# Altium project TASBot64.PrjPCB
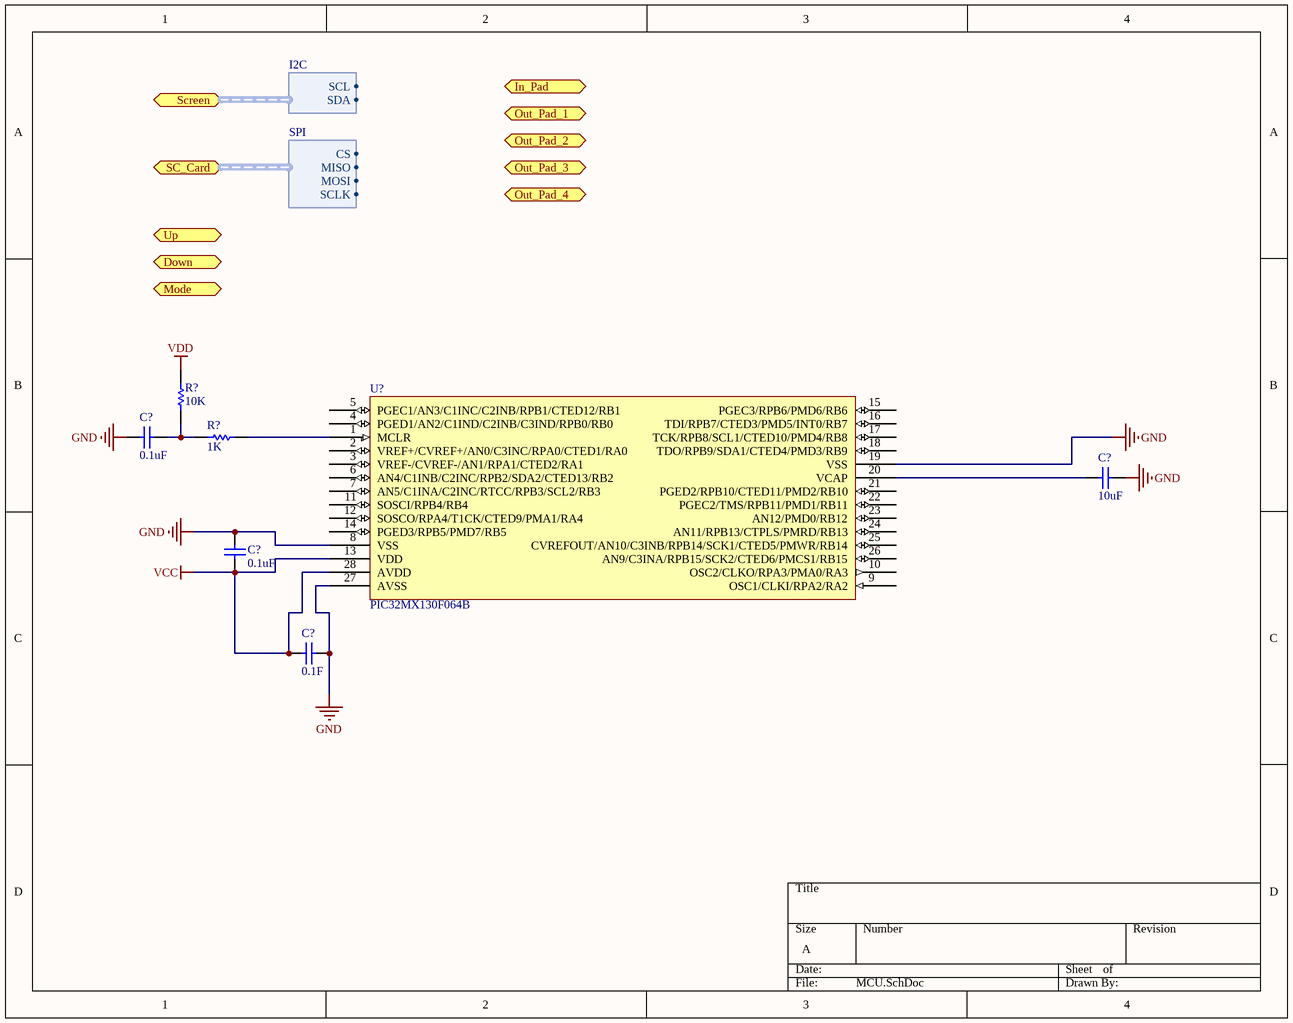
[diagram p0: MCU.SchDoc]
5 sheets, 23 parts. Net scope: hierarchical (ports join the sheet entries above them; power ports are global).
Sheets:
  MCU.SchDoc
  TASBot64.SchDoc
    U_SD = SD.SchDoc
    U_Screen = Screen.SchDoc
    U_Protoboard = Protoboard.SchDoc

## Sheet MCU.SchDoc
size A

### Parts
(Parts that share a designator on the sheet are numbered #1, #2 ... from top to bottom, then left to right.)
C?#1  0.1uF  [RAD-0.3]
C?#2  10uF  [RAD-0.3]
C?#3  0.1uF  [RAD-0.3]
C?#4  0.1F  [RAD-0.3]
R?#1  10K  [AXIAL-0.3]
R?#2  1K  [AXIAL-0.3]
U?#1  PIC32MX130F064B

### Ports
Down (in), In_Pad (bidir), Mode (in), Out_Pad_1 (bidir), Out_Pad_2 (bidir), Out_Pad_3 (bidir), Out_Pad_4 (bidir), SC_Card (harness SPI), Screen (harness I2C), Up (in)

### Harnesses
I2C: SCL, SDA
SPI: CS, MISO, MOSI, SCLK

### Nets
GND: C?#1.1 C?#2.2 C?#3.2 C?#4.2 U?#1.8(VSS) U?#1.19(VSS) U?#1.27(AVSS)
VCC: C?#3.1 C?#4.1 U?#1.13(VDD) U?#1.28(AVDD)
VDD: R?#1.2
NetC?#1_2: C?#1.2 R?#1.1 R?#2.1
NetC?#2_1: C?#2.1 U?#1.20(VCAP)
NetR?#2_2: R?#2.2 U?#1.1(MCLR)

Not connected (* = marked no-connect by the designer): U?#1 2(VREF+/CVREF+/AN0/C3INC/RPA0/CTED1/RA0) 3(VREF-/CVREF-/AN1/RPA1/CTED2/RA1) 4(PGED1/AN2/C1IND/C2INB/C3IND/RPB0/RB0) 5(PGEC1/AN3/C1INC/C2INB/RPB1/CTED12/RB1) 6(AN4/C1INB/C2INC/RPB2/SDA2/CTED13/RB2) 7(AN5/C1INA/C2INC/RTCC/RPB3/SCL2/RB3) 9(OSC1/CLKI/RPA2/RA2) 10(OSC2/CLKO/RPA3/PMA0/RA3) 11(SOSCI/RPB4/RB4) 12(SOSCO/RPA4/T1CK/CTED9/PMA1/RA4) 14(PGED3/RPB5/PMD7/RB5) 15(PGEC3/RPB6/PMD6/RB6) 16(TDI/RPB7/CTED3/PMD5/INT0/RB7) 17(TCK/RPB8/SCL1/CTED10/PMD4/RB8) 18(TDO/RPB9/SDA1/CTED4/PMD3/RB9) 21(PGED2/RPB10/CTED11/PMD2/RB10) 22(PGEC2/TMS/RPB11/PMD1/RB11) 23(AN12/PMD0/RB12) 24(AN11/RPB13/CTPLS/PMRD/RB13) 25(CVREFOUT/AN10/C3INB/RPB14/SCK1/CTED5/PMWR/RB14) 26(AN9/C3INA/RPB15/SCK2/CTED6/PMCS1/RB15)

### Library data of the parts
C?#1-C?#4 = Cap: Capacitor; Published: 8-Jun-2000; LatestRevisionDate: 17-Jul-2002; LatestRevisionNote: Re-released for DXP Platform.; PackageReference: RAD-0.3; Publisher: Altium Limited; PackageDescription: Radial Cap, Thru-Hole; 2 Leads; 0.3 in Pin Spacing
  C?#1 C?#3: Value: 0.1uF
  C?#2: Value: 10uF
  C?#4: Value: 0.1F
R?#1 R?#2 = Res1: Resistor; Published: 8-Jun-2000; LatestRevisionDate: 17-Jul-2002; LatestRevisionNote: Re-released for DXP Platform.; PackageReference: AXIAL-0.3; Publisher: Altium Limited; PackageDescription: Axial Device, Thru-Hole; 2 Leads; 0.3 in Pin Spacing
  R?#1: Value: 10K
  R?#2: Value: 1K
U?#1 = PIC32MX130F064B: Producer: Microchip; ProducerRef: PIC32MX130F064B-I/SP; Supplier: Farnell; SupplierRef: 2097776

## Sheet TASBot64.SchDoc
size A
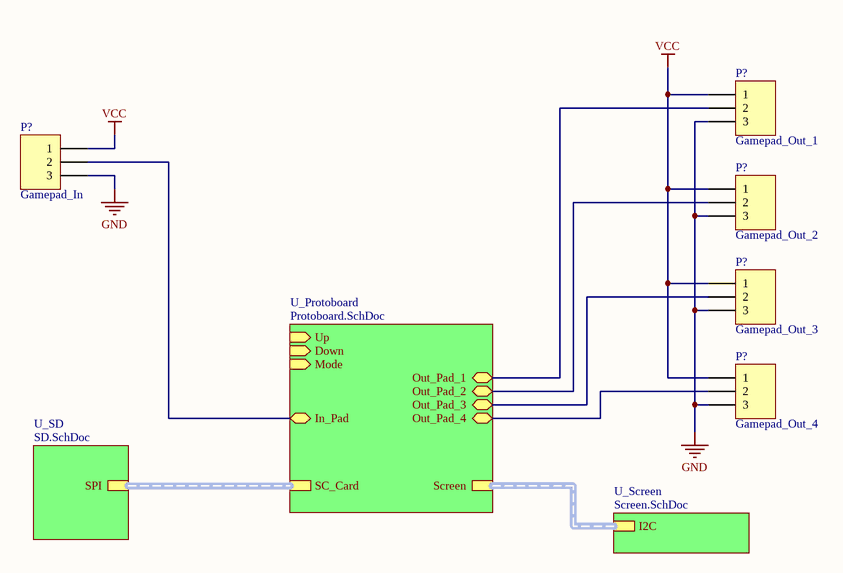
[diagram p1: TASBot64.SchDoc]

### Parts
(Parts that share a designator on the sheet are numbered #1, #2 ... from top to bottom, then left to right.)
P?#1  Gamepad_Out_1  [HDR1X3]
P?#2  Gamepad_In  [HDR1X3]
P?#3  Gamepad_Out_2  [HDR1X3]
P?#4  Gamepad_Out_3  [HDR1X3]
P?#5  Gamepad_Out_4  [HDR1X3]

### Sub-sheets
U_Protoboard = Protoboard.SchDoc: Screen (harness I2C), SC_Card (harness SPI), Up (in), Down (in), Mode (in), In_Pad (bidir), Out_Pad_1 (bidir), Out_Pad_2 (bidir), Out_Pad_3 (bidir), Out_Pad_4 (bidir)
U_Screen = Screen.SchDoc: I2C (harness I2C)
U_SD = SD.SchDoc: SPI (harness SPI)

### Nets
GND: P?#1.3 P?#2.3 P?#3.3 P?#4.3 P?#5.3
VCC: P?#1.1 P?#2.1 P?#3.1 P?#4.1 P?#5.1
NetP?#1_2: P?#1.2 ; sheet U_Protoboard/Out_Pad_1
NetP?#2_2: P?#2.2 ; sheet U_Protoboard/In_Pad
NetP?#3_2: P?#3.2 ; sheet U_Protoboard/Out_Pad_2
NetP?#4_2: P?#4.2 ; sheet U_Protoboard/Out_Pad_3
NetP?#5_2: P?#5.2 ; sheet U_Protoboard/Out_Pad_4

### Buses and harness runs
harness sheet U_Protoboard/SC_Card = sheet U_SD/SPI
harness sheet U_Protoboard/Screen = sheet U_Screen/I2C

### Library data of the parts
P?#1-P?#5 = Header 3: Header, 3-Pin; LatestRevisionDate: 17-Jul-2002; LatestRevisionNote: Re-released for DXP Platform.; Publisher: Altium Limited

## Sheet SD.SchDoc
size A
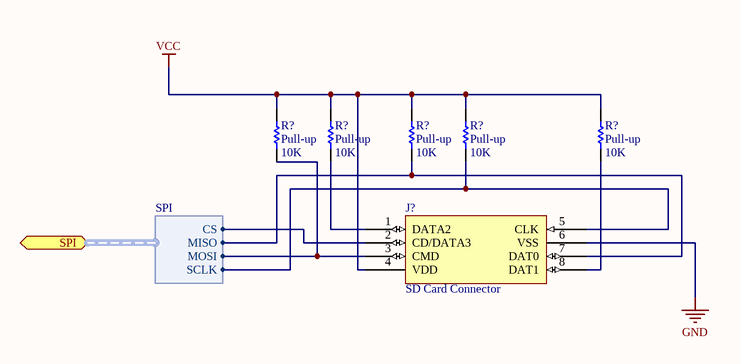
[diagram p2: SD.SchDoc]

### Parts
(Parts that share a designator on the sheet are numbered #1, #2 ... from top to bottom, then left to right.)
J?  SD Card Connector
R?#3  Pull-up  value 10K  [AXIAL-0.3]
R?#4  Pull-up  value 10K  [AXIAL-0.3]
R?#5  Pull-up  value 10K  [AXIAL-0.3]
R?#6  Pull-up  value 10K  [AXIAL-0.3]
R?#7  Pull-up  value 10K  [AXIAL-0.3]

### Ports
SPI (harness SPI)

### Harnesses
SPI: CS, MISO, MOSI, SCLK

### Nets
GND: J?.6(VSS)
VCC: J?.4(VDD) R?#3.2 R?#4.2 R?#5.2 R?#6.2 R?#7.2
NetJ?_1: J?.1(DATA2) R?#4.1
NetJ?_2: J?.2(CD/DATA3) ; port SPI.CS
NetJ?_3: J?.3(CMD) R?#3.1 ; port SPI.MOSI
NetJ?_5: J?.5(CLK) R?#6.1 ; port SPI.SCLK
NetJ?_7: J?.7(DAT0) R?#5.1 ; port SPI.MISO
NetJ?_8: J?.8(DAT1) R?#7.1

### Library data of the parts
J? = 503182-1853: Producer: Molex; CommandePrototype: Yes; ProducerRef: 503182-1853; Supplier: Farnell; SupplierRef: 2334075
R?#3-R?#7 = Res1: Resistor; Published: 8-Jun-2000; LatestRevisionDate: 17-Jul-2002; LatestRevisionNote: Re-released for DXP Platform.; PackageReference: AXIAL-0.3; Publisher: Altium Limited; PackageDescription: Axial Device, Thru-Hole; 2 Leads; 0.3 in Pin Spacing

## Sheet Screen.SchDoc
size A
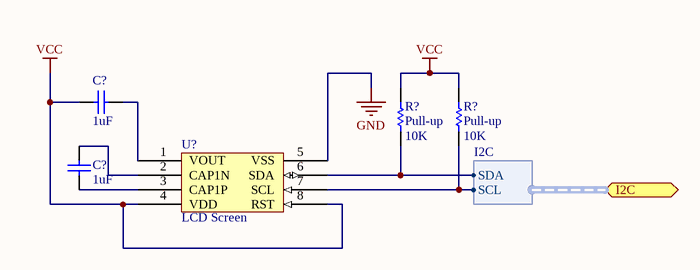
[diagram p3: Screen.SchDoc]

### Parts
(Parts that share a designator on the sheet are numbered #1, #2 ... from top to bottom, then left to right.)
C?#5  1uF  [RAD-0.3]
C?#6  1uF  [RAD-0.3]
R?#8  Pull-up  value 10K  [AXIAL-0.3]
R?#9  Pull-up  value 10K  [AXIAL-0.3]
U?#2  LCD Screen

### Ports
I2C (harness I2C)

### Harnesses
I2C: SCL, SDA

### Nets
GND: U?#2.5(VSS)
VCC: C?#5.2 R?#8.2 R?#9.2 U?#2.4(VDD) U?#2.8(RST)
NetC?#5_1: C?#5.1 U?#2.1(VOUT)
NetC?#6_1: C?#6.1 U?#2.3(CAP1P)
NetC?#6_2: C?#6.2 U?#2.2(CAP1N)
NetR?#8_1: R?#8.1 U?#2.6(SDA) ; port I2C.SDA
NetR?#9_1: R?#9.1 U?#2.7(SCL) ; port I2C.SCL

### Library data of the parts
C?#5 C?#6 = Cap: Capacitor; Published: 8-Jun-2000; LatestRevisionDate: 17-Jul-2002; LatestRevisionNote: Re-released for DXP Platform.; PackageReference: RAD-0.3; Publisher: Altium Limited; PackageDescription: Radial Cap, Thru-Hole; 2 Leads; 0.3 in Pin Spacing; Value: 1uF
R?#8 R?#9 = Res1: Resistor; Published: 8-Jun-2000; LatestRevisionDate: 17-Jul-2002; LatestRevisionNote: Re-released for DXP Platform.; PackageReference: AXIAL-0.3; Publisher: Altium Limited; PackageDescription: Axial Device, Thru-Hole; 2 Leads; 0.3 in Pin Spacing
U?#2 = MCCOG22005A6W-BNMLWI: Producer: Midas; CommandePrototype: Yes; Supplier: Farnell; SupplierRef: 2218944; ProducerRef: MCCOG22005A6W-BNMLWI

## Sheet Protoboard.SchDoc
size A
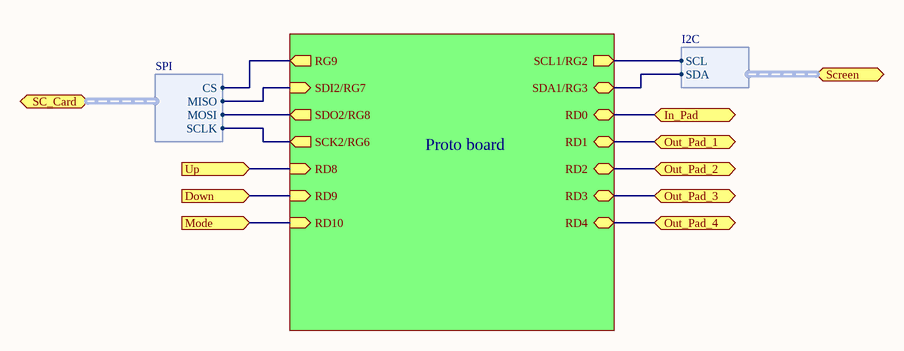
[diagram p4: Protoboard.SchDoc]

### Sub-sheets
Proto board = ?: SDI2/RG7 (in), SDO2/RG8 (out), SCK2/RG6 (out), RD8 (in), RD9 (in), RD10 (in), SCL1/RG2 (out), RD0, RD1, RD2, RD3, RD4, SDA1/RG3, RG9 (out)

### Ports
Down (in), In_Pad (bidir), Mode (in), Out_Pad_1 (bidir), Out_Pad_2 (bidir), Out_Pad_3 (bidir), Out_Pad_4 (bidir), SC_Card (harness SPI), Screen (harness I2C), Up (in)

### Harnesses
I2C: SCL, SDA
SPI: CS, MISO, MOSI, SCLK

### Nets
NetJ?_2: sheet Proto board/RG9, port SC_Card.CS
NetJ?_3: sheet Proto board/SDO2/RG8, port SC_Card.MOSI
NetJ?_5: sheet Proto board/SCK2/RG6, port SC_Card.SCLK
NetJ?_7: sheet Proto board/SDI2/RG7, port SC_Card.MISO
NetP?#1_2: port Out_Pad_1, sheet Proto board/RD1
NetP?#2_2: port In_Pad, sheet Proto board/RD0
NetP?#3_2: port Out_Pad_2, sheet Proto board/RD2
NetP?#4_2: port Out_Pad_3, sheet Proto board/RD3
NetP?#5_2: port Out_Pad_4, sheet Proto board/RD4
NetR?#8_1: sheet Proto board/SDA1/RG3, port Screen.SDA
NetR?#9_1: sheet Proto board/SCL1/RG2, port Screen.SCL
(unnamed): port Up, sheet Proto board/RD8
(unnamed): port Down, sheet Proto board/RD9
(unnamed): port Mode, sheet Proto board/RD10

## Nets that join several sheets
GND: MCU (7 pins), TASBot64 (5 pins), SD (J?.6), Screen (U?#2.5)
VCC: MCU (C?#3.1 C?#4.1 U?#1.13 U?#1.28), TASBot64 (5 pins), SD (6 pins), Screen (5 pins)